# Altium schematic sheet 随便画的传感器原理图.SchDoc
size A4
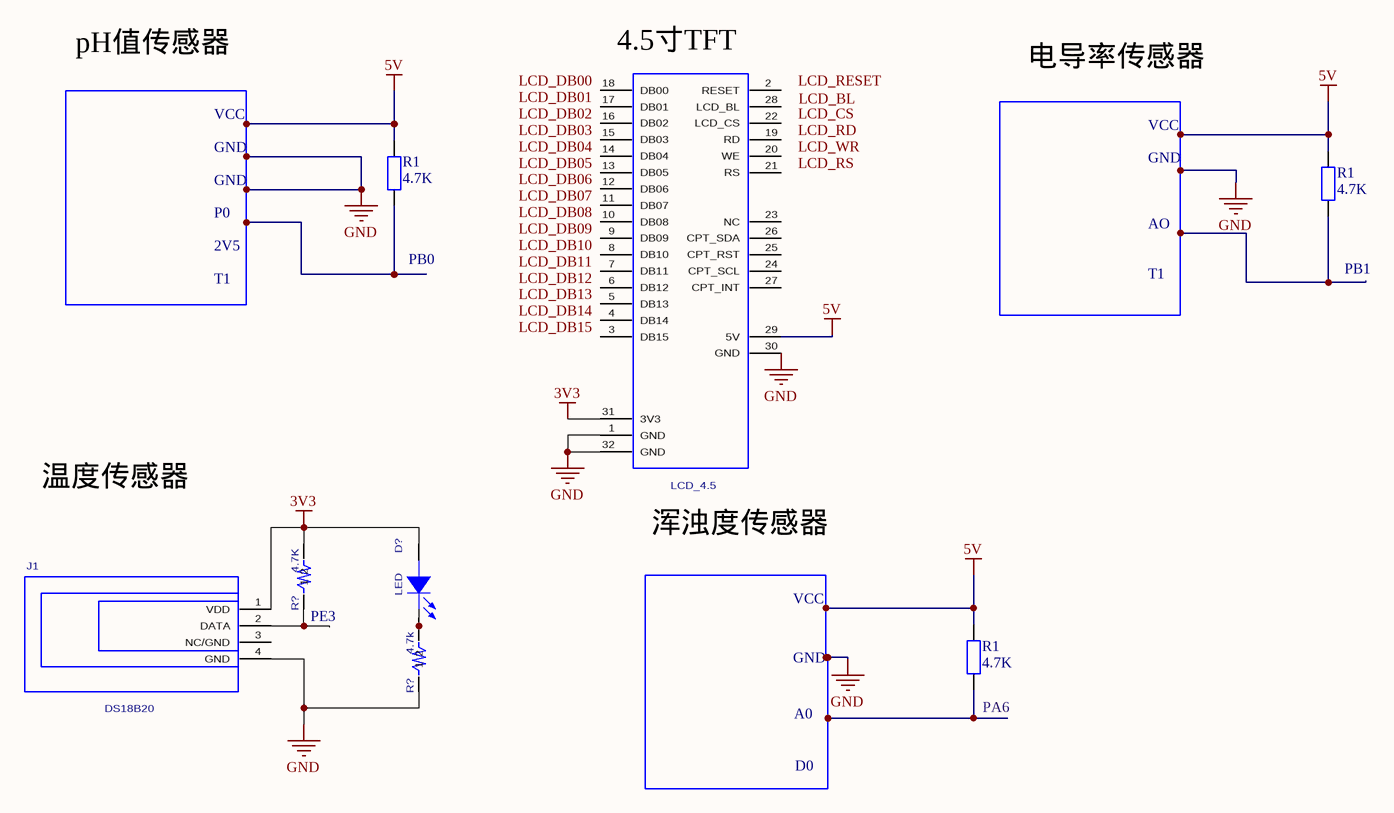
[diagram p0: 随便画的传感器原理图.SchDoc]

## Parts
(Parts that share a designator on the sheet are numbered #1, #2 ... from top to bottom, then left to right.)
D?  value LED  [LED_0603]  (hidden comment: LED_RED_0603)
J1  DS18B20  [HDR1X4]
J?  LCD_4.5  [2X16X2.54MM]
R1#1  4.7K  [R 0402]
R1#2  4.7K  [R 0402]
R1#3  4.7K  [R 0402]
R?#1  value 4.7K  [R_0603]  (hidden comment: R_1K_0603)
R?#2  value 4.7k  [R_0603]  (hidden comment: R_1K_0603)

## Nets
3V3: D?.A(ANODE) J1.1(VDD) J?.31(3V3) R?#1.2
5V: J1.4(GND) J?.1(GND) J?.29(5V) J?.30(GND) J?.32(GND) R1#1.1 R1#1.2 R1#2.1 R1#2.2 R1#3.1 R1#3.2 R?#2.1  [also labelled GND]
NetD?_K: D?.K(CATHODE) R?#2.2
NetJ1_2: J1.2(DATA) R?#1.1

Not connected (* = marked no-connect by the designer): J1 3(NC/GND); J? 2(RESET) 3(DB15) 4(DB14) 5(DB13) 6(DB12) 7(DB11) 8(DB10) 9(DB09) 10(DB08) 11(DB07) 12(DB06) 13(DB05) 14(DB04) 15(DB03) 16(DB02) 17(DB01) 18(DB00) 19(RD) 20(WE) 21(RS) 22(LCD_CS) 23(NC) 24(CPT_SCL) 25(CPT_RST) 26(CPT_SDA) 27(CPT_INT) 28(LCD_BL)

## Notes on the sheet
- pH值传感器
- VCC
- (near J?) 4.5寸TFT
- 电导率传感器
- GND
- P0
- 2V5
- T1
- (near R1#1) PB0
- AO
- (near R1#2) PB1
- 温度传感器
- (near J?) 浑浊度传感器
- (near R?#1) PE3
- A0
- D0
- Labels drawn without touching a wire or pin: LCD_BL, LCD_CS, LCD_DB00, LCD_DB01, LCD_DB02, LCD_DB03, LCD_DB04, LCD_DB05, LCD_DB06, LCD_DB07, LCD_DB08, LCD_DB09, LCD_DB10, LCD_DB11, LCD_DB12, LCD_DB13, LCD_DB14, LCD_DB15, LCD_RD, LCD_RESET, LCD_RS, LCD_WR, PA6

## Library data of the parts
J1 = DHT11/DS18B20: Manufacture 1 P/N: DHT11/DS1302; PCB DECAL: HDR1X4
J? = LCD_4.5: Value: 2X26PINX2.54MM; PCB DECAL: 2X16X2.54MM
R1#1-R1#3 = R: 贴片电阻; 版权归属: 源创客; BOM名称: 贴片电阻; 学习资源: www.ooocke.com
D? = LED_RED_0603: PCB DECAL: LED_0603
R?#1 R?#2 = R_1K_0603: PCB DECAL: R_0603